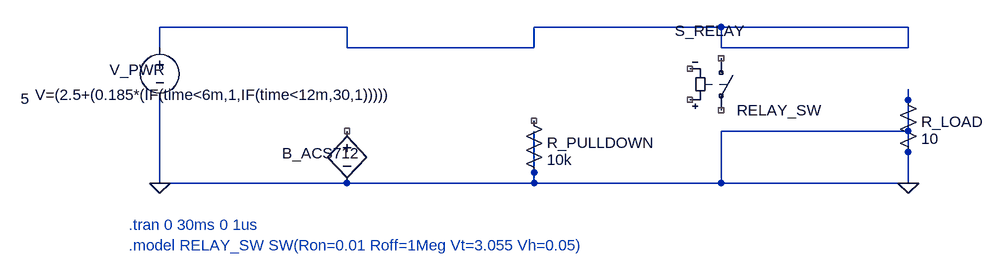
[diagram p0: schematic short_circuit_detector.asc]
short_circuit_detector.asc, the LTspice schematic file:
Version 4.1
SHEET 1 2400 1600
WIRE 496 96 208 96
WIRE 1072 96 784 96
WIRE 1360 96 1072 96
WIRE 208 128 208 96
WIRE 496 128 496 96
WIRE 784 128 784 96
WIRE 784 128 496 128
WIRE 1072 128 1072 96
WIRE 1360 128 1360 96
WIRE 1360 128 1072 128
WIRE 1360 208 1360 192
WIRE 1360 256 1360 208
WIRE 1360 256 1072 256
WIRE 1360 288 1360 256
WIRE 784 320 784 256
WIRE 208 336 208 208
WIRE 496 336 208 336
WIRE 784 336 784 320
WIRE 784 336 496 336
WIRE 1072 336 1072 256
WIRE 1072 336 784 336
WIRE 1360 336 1360 288
WIRE 1360 336 1072 336
FLAG 208 336 0
FLAG 1360 336 0
SYMBOL voltage 208 112 R0
WINDOW 0 -77 50 Left 2
WINDOW 3 -214 94 Left 2
SYMATTR InstName V_PWR
SYMATTR Value 5
SYMBOL bv 496 240 R0
WINDOW 0 -100 50 Left 2
WINDOW 3 -480 -40 Left 2
SYMATTR InstName B_ACS712
SYMATTR Value V=(2.5+(0.185*(IF(time<6m,1,IF(time<12m,30,1)))))
SYMBOL res 768 224 R0
WINDOW 0 36 50 Left 2
SYMATTR InstName R_PULLDOWN
SYMATTR Value 10k
SYMBOL sw 1072 128 R0
WINDOW 0 -71 -26 Left 2
SYMATTR InstName S_RELAY
SYMATTR Value RELAY_SW
SYMBOL res 1344 192 R0
WINDOW 0 36 50 Left 2
SYMATTR InstName R_LOAD
SYMATTR Value 10
TEXT 160 400 Left 2 ;.tran 0 30ms 0 1us
TEXT 160 432 Left 2 ;.model RELAY_SW SW(Ron=0.01 Roff=1Meg Vt=3.055 Vh=0.05)

The netlist it stands for:
* short_circuit_detector.asc
V_PWR N001 0 5
B_ACS712 NC_01 0 V=(2.5+(0.185*(IF(time<6m,1,IF(time<12m,30,1)))))
R_PULLDOWN NC_02 0 10k
S_RELAY NC_03 NC_04 NC_05 NC_06 RELAY_SW
R_LOAD 0 0 10
* .tran 0 30ms 0 1us
* .model RELAY_SW SW(Ron=0.01 Roff=1Meg Vt=3.055 Vh=0.05)
.backanno
.end